# Altium schematic sheet РЕУН.468323.001_USB-UART.SchDoc: =Name-1str
size 420 x 297 mm; SheetNumber: 9; Вид изделия: Документация; Раздел: Документация; Код документа: Э3; Вид документа: Схема электрическая принципиальная; Класс документа: Конструкторский документ; Создавать изделие в PLM: Yes; DocumentCode: РЕУН.468323.001 Э3 2D; DocumentView: Схема электрическая принципиальная; DocumentClass: Конструкторский документ; ProductView: Документация; Format: А3
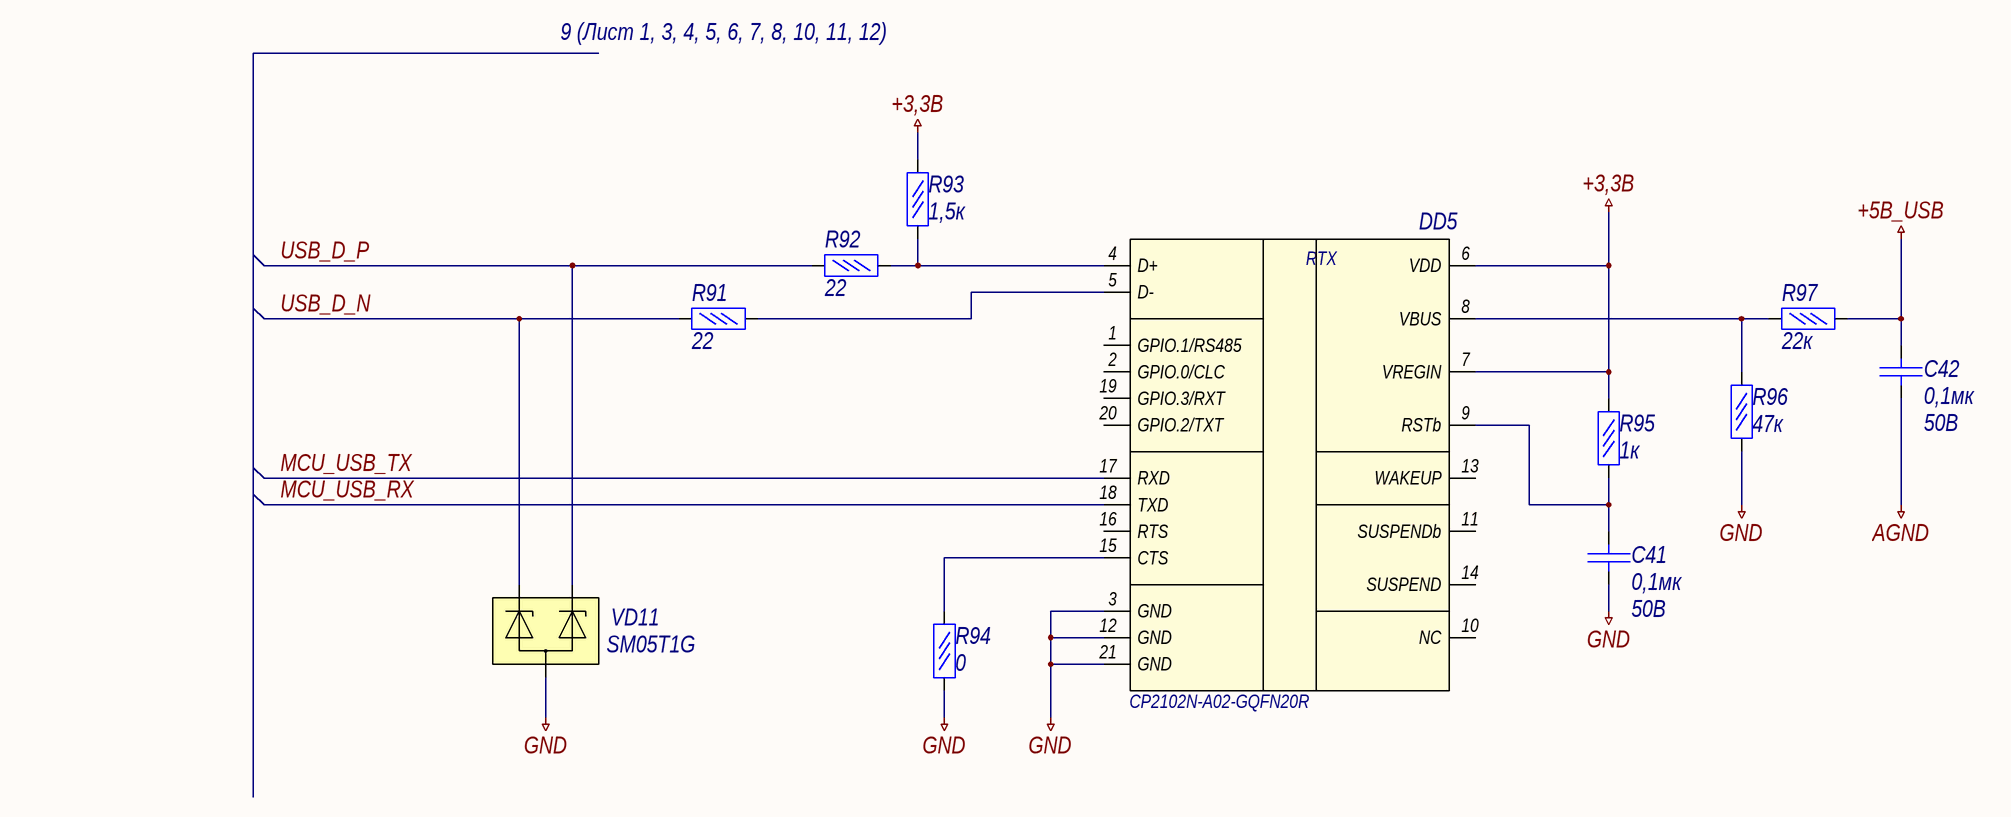
[diagram p0: РЕУН.468323.001_USB-UART.SchDoc]

## Parts
C41  Voltage: 50В  [C0805_AA]  (hidden comment: 0,1мк)
C42  Voltage: 50В  [C0805_AA]  (hidden comment: 0,1мк)
DD5  CP2102N-A02-GQFN20R
R91  22  [R1206]
R92  22  [R1206]
R93  5: 1,5к  [R1206]
R94  0  [R1206]
R95  1к  [R1206]
R96  47к  [R1206]
R97  22к  [R1206]
VD11  SM05T1G

## Nets
+3,3В: DD5.6(VDD) DD5.7(VREGIN) R93.2 R95.2
+5В_USB: C42.2 R97.2
AGND: C42.1
GND: C41.1 DD5.3(GND) DD5.12(GND) DD5.21(GND) R94.1 R96.1 VD11.3
MCU_USB_RX: DD5.18(TXD)
MCU_USB_TX: DD5.17(RXD)
USB_D_N: R91.1 VD11.1
USB_D_P: R92.1 VD11.2
NetC41_2: C41.2 DD5.9(RSTb) R95.1
NetDD5_4: DD5.4(D+) R92.2 R93.1
NetDD5_5: DD5.5(D-) R91.2
NetDD5_8: DD5.8(VBUS) R96.2 R97.1
NetDD5_15: DD5.15(CTS) R94.2

Not connected (* = marked no-connect by the designer): DD5 1(GPIO.1/RS485) 2(GPIO.0/CLC) 10(NC) 11(SUSPENDb) 13(WAKEUP) 14(SUSPEND) 16(RTS) 19(GPIO.3/RXT) 20(GPIO.2/TXT)

## Notes on the sheet
- 9 (Лист 1, 3, 4, 5, 6, 7, 8, 10, 11, 12)
- Подп. и дата
- Инв. № дубл.
- Взам. инв. №
- Инв. № подл.
- Лист
- Изм.
- № докум.
- Подп.
- Дата
- Копировал
- Формат
- (in symbol CP2102N-A02-GQFN20R) RTX

## Library data of the parts
C41 C42 = Конденсатор кер.: Value: 0,1мк
DD5 = CP2102N-A02-GQFN20R: USB-UART преобразователь
R91-R97 = Резистор  0,05Вт: Резистор 0,05Вт; Power rating: 0,05Вт
  R91 R92: Value: 22
  R94: Value: 0
  R95: Value: 1к
  R96: Value: 47к
  R97: Value: 22к
VD11 = ZenerArray2: Сборка TVS-диодов